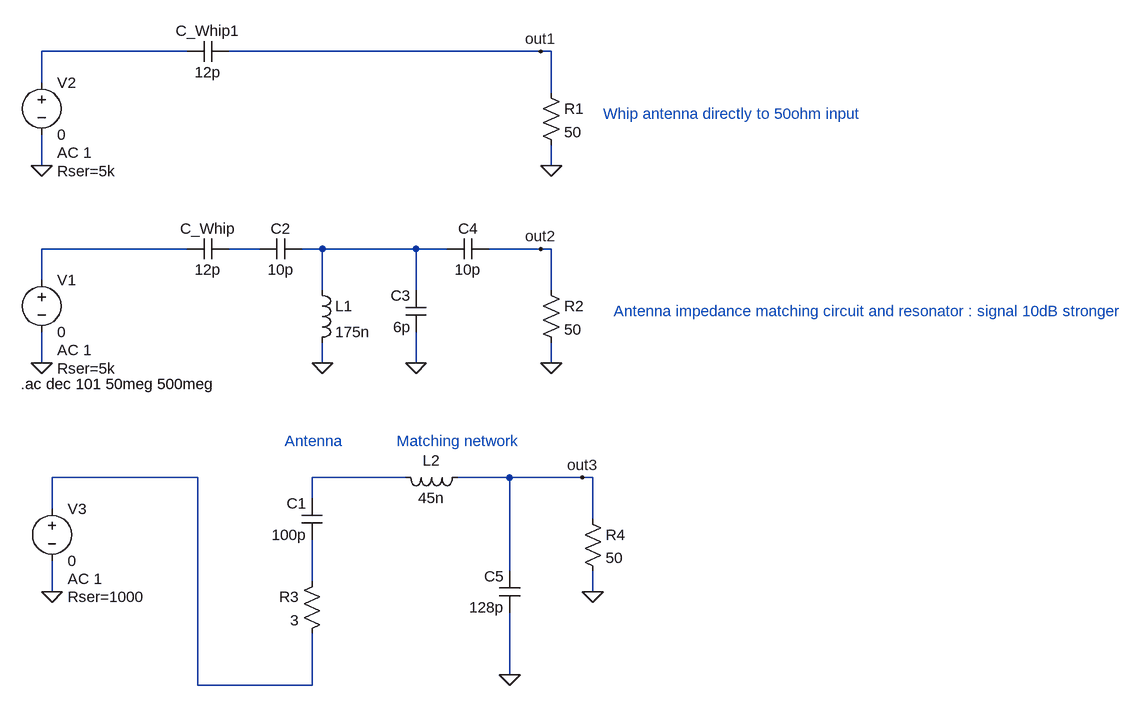
[diagram p0: schematic antenna_frontend.asc]
antenna_frontend.asc, the LTspice schematic file:
Version 4
SHEET 1 1792 756
WIRE 288 -240 64 -240
WIRE 832 -240 352 -240
WIRE 848 -240 832 -240
WIRE 64 -192 64 -240
WIRE 848 -176 848 -240
WIRE 64 -64 64 -112
WIRE 848 -64 848 -96
WIRE 288 64 64 64
WIRE 400 64 352 64
WIRE 496 64 464 64
WIRE 640 64 496 64
WIRE 688 64 640 64
WIRE 832 64 752 64
WIRE 848 64 832 64
WIRE 64 112 64 64
WIRE 496 128 496 64
WIRE 640 128 640 64
WIRE 848 128 848 64
WIRE 64 240 64 192
WIRE 496 240 496 208
WIRE 640 240 640 192
WIRE 848 240 848 208
WIRE 304 416 80 416
WIRE 624 416 480 416
WIRE 784 416 704 416
WIRE 896 416 784 416
WIRE 912 416 896 416
WIRE 480 448 480 416
WIRE 80 464 80 416
WIRE 912 480 912 416
WIRE 784 560 784 416
WIRE 480 576 480 512
WIRE 80 592 80 544
WIRE 912 592 912 560
WIRE 784 720 784 624
WIRE 304 736 304 416
WIRE 480 736 480 656
WIRE 480 736 304 736
FLAG 64 240 0
FLAG 848 240 0
FLAG 496 240 0
FLAG 640 240 0
FLAG 832 64 out2
FLAG 64 -64 0
FLAG 848 -64 0
FLAG 832 -240 out1
FLAG 784 720 0
FLAG 80 592 0
FLAG 912 592 0
FLAG 896 416 out3
SYMBOL voltage 64 96 R0
WINDOW 123 24 124 Left 2
WINDOW 39 24 152 Left 2
SYMATTR Value2 AC 1
SYMATTR SpiceLine Rser=5k
SYMATTR InstName V1
SYMATTR Value 0
SYMBOL cap 352 48 R90
WINDOW 0 0 32 VBottom 2
WINDOW 3 32 32 VTop 2
SYMATTR InstName C_Whip
SYMATTR Value 12p
SYMBOL cap 464 48 R90
WINDOW 0 0 32 VBottom 2
WINDOW 3 32 32 VTop 2
SYMATTR InstName C2
SYMATTR Value 10p
SYMBOL cap 656 192 R180
WINDOW 0 24 56 Left 2
WINDOW 3 24 8 Left 2
SYMATTR InstName C3
SYMATTR Value 6p
SYMBOL ind 480 112 R0
SYMATTR InstName L1
SYMATTR Value 175n
SYMBOL cap 752 48 R90
WINDOW 0 0 32 VBottom 2
WINDOW 3 32 32 VTop 2
SYMATTR InstName C4
SYMATTR Value 10p
SYMBOL res 832 112 R0
SYMATTR InstName R2
SYMATTR Value 50
SYMBOL voltage 64 -208 R0
WINDOW 123 24 124 Left 2
WINDOW 39 24 152 Left 2
SYMATTR Value2 AC 1
SYMATTR SpiceLine Rser=5k
SYMATTR InstName V2
SYMATTR Value 0
SYMBOL cap 352 -256 R90
WINDOW 0 0 32 VBottom 2
WINDOW 3 32 32 VTop 2
SYMATTR InstName C_Whip1
SYMATTR Value 12p
SYMBOL res 832 -192 R0
SYMATTR InstName R1
SYMATTR Value 50
SYMBOL res 496 560 M0
SYMATTR InstName R3
SYMATTR Value 3
SYMBOL cap 496 448 M0
SYMATTR InstName C1
SYMATTR Value 100p
SYMBOL ind 608 400 M90
WINDOW 0 5 56 VBottom 2
WINDOW 3 32 56 VTop 2
SYMATTR InstName L2
SYMATTR Value 45n
SYMBOL cap 800 560 M0
SYMATTR InstName C5
SYMATTR Value 128p
SYMBOL voltage 80 448 R0
WINDOW 123 24 124 Left 2
WINDOW 39 24 152 Left 2
SYMATTR Value2 AC 1
SYMATTR SpiceLine Rser=1000
SYMATTR InstName V3
SYMATTR Value 0
SYMBOL res 896 464 R0
SYMATTR InstName R4
SYMATTR Value 50
TEXT 32 272 Left 2 !.ac dec 101 50meg 500meg
TEXT 928 -144 Left 2 ;Whip antenna directly to 50ohm input
TEXT 944 160 Left 2 ;Antenna impedance matching circuit and resonator : signal 10dB stronger
TEXT 528 360 Right 2 ;Antenna
TEXT 800 360 Right 2 ;Matching network

The netlist it stands for:
* antenna_frontend.asc
V1 N002 0 0 AC 1 Rser=5k
C_Whip N003 N002 12p
C2 N004 N003 10p
C3 0 N004 6p
L1 N004 0 175n
C4 out2 N004 10p
R2 out2 0 50
V2 N001 0 0 AC 1 Rser=5k
C_Whip1 out1 N001 12p
R1 out1 0 50
R3 N007 N005 3
C1 N006 N007 100p
L2 N006 out3 45n
C5 out3 0 128p
V3 N005 0 0 AC 1 Rser=1000
R4 out3 0 50
.ac dec 101 50meg 500meg
* Whip antenna directly to 50ohm input
* Antenna impedance matching circuit and resonator : signal 10dB stronger
* Antenna
* Matching network
.backanno
.end